# EAGLE design node_V1 (EAGLE 9.1.0)
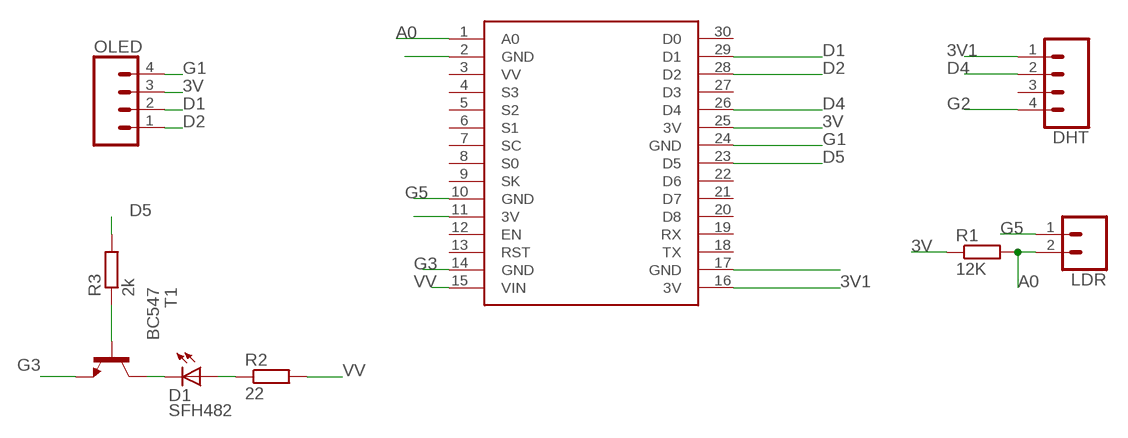
[diagram p0: schematic, sheet 1]

## Parts
D1  SFH482  [SFH482]
DHT  CONN_04LONGPADS  [1X04_LONGPADS]
LDR  CONN_02PTH3  [1X02_LONGPADS]
OLED  CONN_04LONGPADS  [1X04_LONGPADS]
R1  12K  R-EU_0207/10  [0207/10]
R2  22  R-EU_0207/10  [0207/10]
R3  2k  R-EU_0207/10  [0207/10]
T1  BC547  [TO92]
U$2  NODEMCU  [NODEMCU]

## Nets
3V: OLED.3 R1.1 U$2.25(3V)
3V1: DHT.1 U$2.16(3V)
3V2: U$2.11(3V)
A0: LDR.2 R1.2 U$2.1(A0)
D1: OLED.2 U$2.29(D1)
D2: OLED.1 U$2.28(D2)
D4: DHT.2 U$2.26(D4)
D5: R3.2 U$2.23(D5)
G1: OLED.4 U$2.24(GND)
G2: DHT.4 U$2.17(GND)
G3: T1.1(E) U$2.14(GND)
G5: LDR.1 U$2.2(GND) U$2.10(GND)
N$3: D1.K(C) T1.3(C)
N$6: D1.A R2.1
N$7: R3.1 T1.2(B)
VV: R2.2 U$2.15(VIN)
Unconnected: DHT.3 U$2.3(VV) U$2.4(S3) U$2.5(S2) U$2.6(S1) U$2.7(SC) U$2.8(S0) U$2.9(SK) U$2.12(EN) U$2.13(RST) U$2.18(TX) U$2.19(RX) U$2.20(D8) U$2.21(D7) U$2.22(D6) U$2.27(D3) U$2.30(D0)

## Library data of the parts
D1 = led:SFH482: IR LED infrared emitting diode, Infineon
DHT OLED = SparkFun-Connectors:CONN_04: Multi connection point. Often used as Generic Header-pin footprint for 0.1 inch spaced/style header connections On any of the 0.1 inch spaced packages, you can populate with these: Break Away Headers - Straight <https://www.sparkfun.com/products/116> (PRT-00116) Break Away Male Headers - Right Angle <https://www.sparkfun.com/products/553> (PRT-00553) Female Headers <https://www.sparkfun.com/products/115> (PRT-00115) Break Away Headers - Machine Pin <https://www.sparkfun.com/products/117> (PRT-00117) Break Away Female Headers - Swiss Machine Pin <https://www.sparkfun.com/products/743> (PRT-00743) For SCREWTERMINALS and SPRING TERMINALS visit here: Screw Terimnals on SparkFun.com <https://www.sparkfun.com/search/results?term=Screw+Terminals> (5mm/3.5mm/2.54mm spacing) This device is also useful as a general connection point to wire up your design to another part of your project. Our various solder wires solder well into these plated through hole pads. Hook-Up Wire - Assortment (Stranded, 22 AWG) <https://www.sparkfun.com/products/11375> (PRT-11375) Hook-Up Wire - Assortment (Solid Core, 22 AWG) <https://www.sparkfun.com/products/11367> (PRT-11367) View the entire wire category on our website here <https://www.sparkfun.com/categories/141> Special notes: Molex polarized connector foot print use with SKU : PRT-08231 with associated crimp pins and housings. 1MM SMD Version SKU: PRT-10208; PROD_ID: CONN-09696
LDR = SparkFun-Connectors:CONN_02: Multi connection point. Often used as Generic Header-pin footprint for 0.1 inch spaced/style header connections On any of the 0.1 inch spaced packages, you can populate with these: Break Away Headers - Straight <https://www.sparkfun.com/products/116> (PRT-00116) Break Away Male Headers - Right Angle <https://www.sparkfun.com/products/553> (PRT-00553) Female Headers <https://www.sparkfun.com/products/115> (PRT-00115) Break Away Headers - Machine Pin <https://www.sparkfun.com/products/117> (PRT-00117) Break Away Female Headers - Swiss Machine Pin <https://www.sparkfun.com/products/743> (PRT-00743) For SCREWTERMINALS and SPRING TERMINALS visit here: Screw Terimnals on SparkFun.com <https://www.sparkfun.com/search/results?term=Screw+Terminals> (5mm/3.5mm/2.54mm spacing) This device is also useful as a general connection point to wire up your design to another part of your project. Our various solder wires solder well into these plated through hole pads. Hook-Up Wire - Assortment (Stranded, 22 AWG) <https://www.sparkfun.com/products/11375> (PRT-11375) Hook-Up Wire - Assortment (Solid Core, 22 AWG) <https://www.sparkfun.com/products/11367> (PRT-11367) View the entire wire category on our website here <https://www.sparkfun.com/categories/141> Special notes: Molex polarized connector foot print use with: PRT-08233 with associated crimp pins and housings. 2.54_SCREWTERM for use with PRT-10571. 3.5mm Screw Terminal footprints for PRT-08084 5mm Screw Terminal footprints for use with PRT-08432
R1-R3 = rcl:R-EU_: RESISTOR, European symbol; SPICEPREFIX: R
T1 = transistor-neu-to92:BC547: NPN TRANSISTOR
U$2 = nodemcu:NODEMCU

## Board
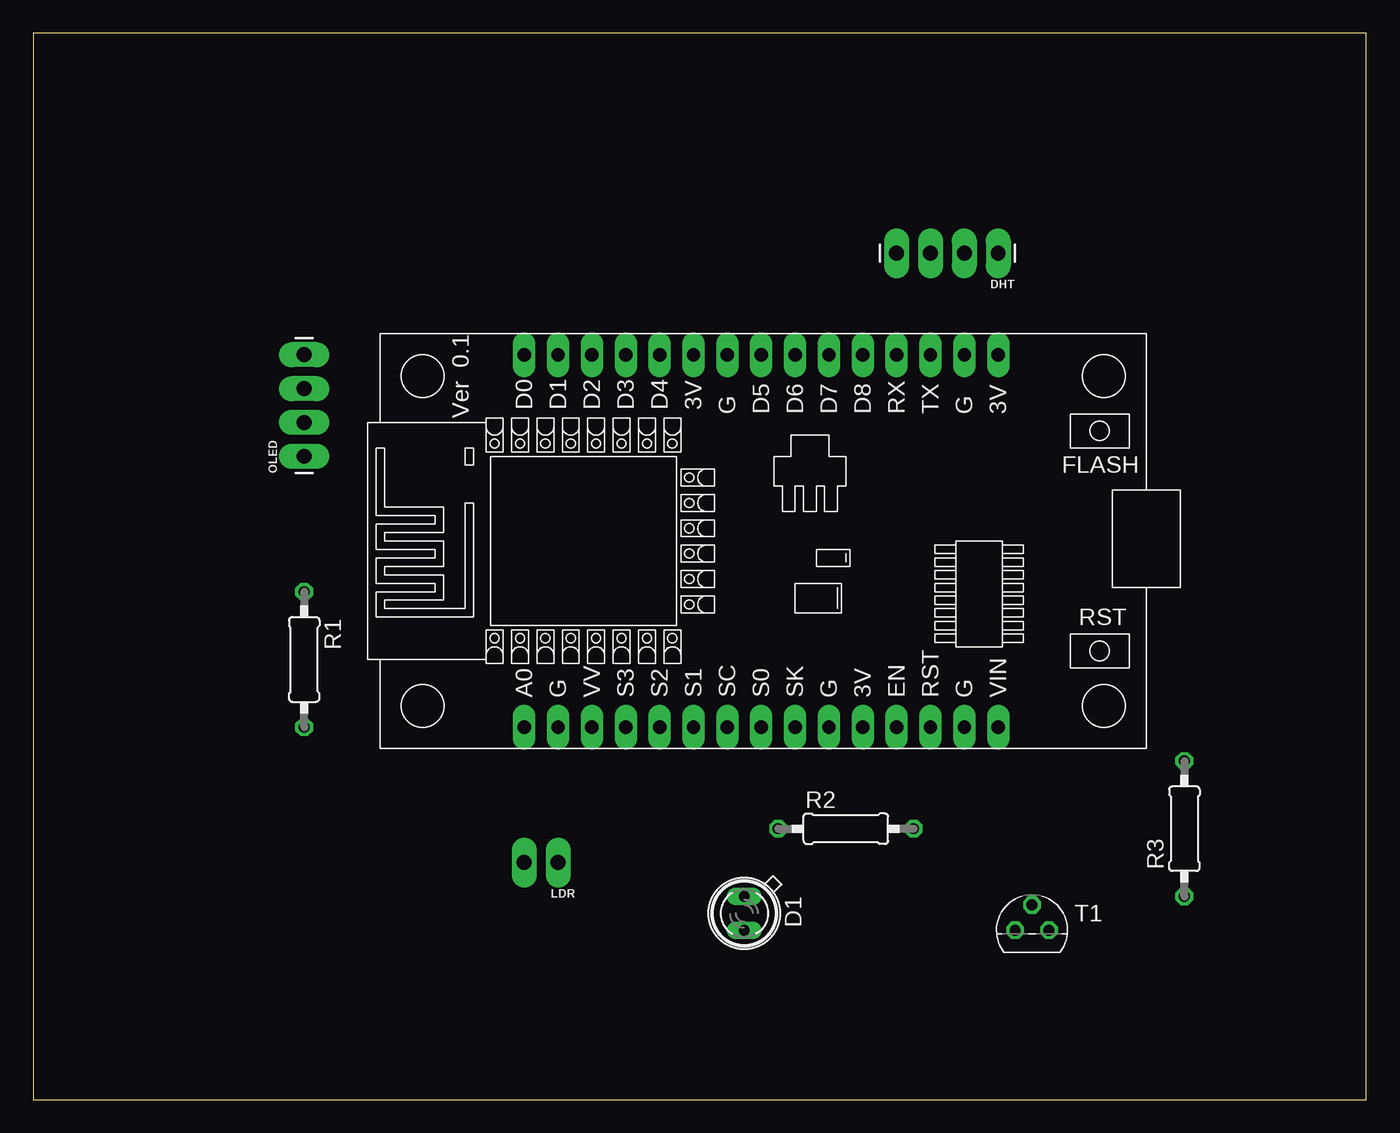
[diagram p1: board, top side]
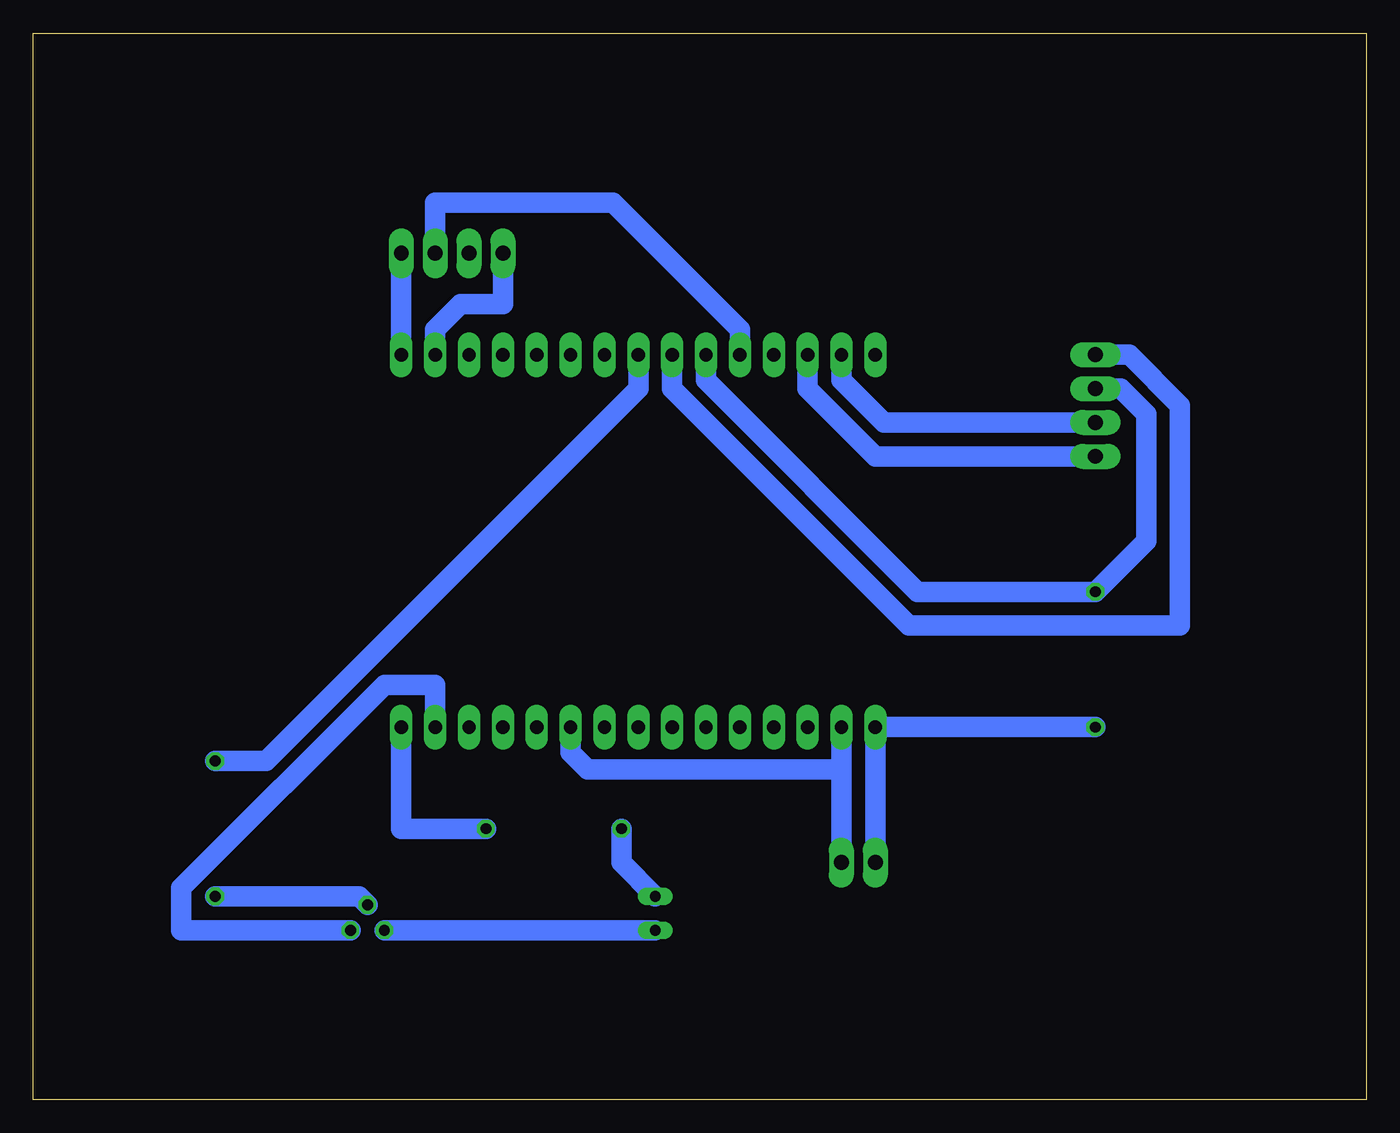
[diagram p2: board, bottom side, seen from below]

Size 100 x 80 mm. Coordinates in mm from the lower left corner, seen from the top.
Outline: 0,0 100,0 100,80 0,80 0,0
Copper layers (1*16): Top 0.035mm / dielectric 1.5mm / Bottom 0.035mm
Design rules "default *": minimum track width 60mil, minimum drill 0.35mm, track to track 24mil, track to pad 24mil, pad to pad 24mil, via to via 24mil, smd to smd 24mil, copper to edge 40mil, drill to drill 6mil, minimum pad ring 10mil, minimum via ring 8mil, stop-mask expansion 4mil, vias tented up to drill 0mil, thermal gap 10mil

### Footprints (pad centres in the part's own frame; a part is rotated, then mirrored left to right if it is on the bottom)
SFH482 = drill 0.813 long: A -1.27,0; K 1.27,0
1X04_LONGPADS = drill 1.118 pad 1.88 long: 1 0,0; 2 2.54,0; 3 5.08,0; 4 7.62,0
1X02_LONGPADS = drill 1.118 pad 1.88 long: 1 0,0; 2 2.54,0
0207/10 = drill 0.813 octagon: 1 -5.08,0; 2 5.08,0
TO92 = drill 0.813 octagon: 1 1.27,0; 2 0,1.905; 3 -1.27,0
NODEMCU = drill 1 pad 1.676 long: 1 -13.97,17.78; 2 -13.97,15.24; 3 -13.97,12.7; 4 -13.97,10.16; 5 -13.97,7.62; 6 -13.97,5.08; 7 -13.97,2.54; 8 -13.97,0; 9 -13.97,-2.54; 10 -13.97,-5.08; 11 -13.97,-7.62; 12 -13.97,-10.16; 13 -13.97,-12.7; 14 -13.97,-15.24; 15 -13.97,-17.78; 16 13.97,-17.78; 17 13.97,-15.24; 18 13.97,-12.7; 19 13.97,-10.16; 20 13.97,-7.62; 21 13.97,-5.08; 22 13.97,-2.54; 23 13.97,0; 24 13.97,2.54; 25 13.97,5.08; 26 13.97,7.62; 27 13.97,10.16; 28 13.97,12.7; 29 13.97,15.24; 30 13.97,17.78

### Placement (x,y rotation side)
D1  53.34,13.97 270 top
DHT  72.39,63.5 180 top
LDR  39.37,17.78 180 top
OLED  20.32,48.26 90 top
R1  20.32,33.02 270 top
R2  60.96,20.32 0 top
R3  86.36,20.32 90 top
T1  74.93,12.7 0 top
U$2  54.61,41.91 90 top

### Tracks (layer width: path | path; a pad name or v marks a point on that pad's centre or on a via)
3V
  Bottom 1.524: OLED.3 18.41,53.34 16.51,51.44 16.51,41.91 R1.1 33.66,38.1 49.53,53.98 U$2.25
3V1
  Bottom 1.524: DHT.1 U$2.16
A0
  Bottom 1.524: R1.2 U$2.1 LDR.2
D1
  Bottom 1.524: U$2.29 39.37,53.98 36.2,50.8 OLED.2
D2
  Bottom 1.524: U$2.28 41.91,53.34 36.83,48.26 OLED.1
D4
  Bottom 1.524: U$2.26 46.99,57.78 56.52,67.31 69.85,67.31 DHT.2
D5
  Bottom 1.524: R3.2 82.55,25.4 54.61,53.34 U$2.23
G1
  Bottom 1.524: U$2.24 52.07,53.34 34.29,35.56 13.97,35.56 13.97,52.07 17.78,55.88 OLED.4
G2
  Bottom 1.524: U$2.17 69.85,57.78 67.94,59.69 64.77,59.69 DHT.4
G3
  Bottom 1.524: T1.1 88.9,12.7 88.9,15.88 73.66,31.11 69.85,31.11 U$2.14
G5
  Bottom 1.524: LDR.1 39.37,24.77 | 39.37,24.77 U$2.2 | U$2.10 59.69,26.04 58.42,24.77 39.37,24.77
N$3
  Bottom 1.524: T1.3 D1.K
N$6
  Bottom 1.524: D1.A 55.88,17.78 R2.1
N$7
  Bottom 1.524: T1.2 75.56,15.24 R3.1
VV
  Bottom 1.524: R2.2 72.39,20.32 U$2.15